# EAGLE design MPU9250-IMU(I2C_V1) (EAGLE 6.5.0)
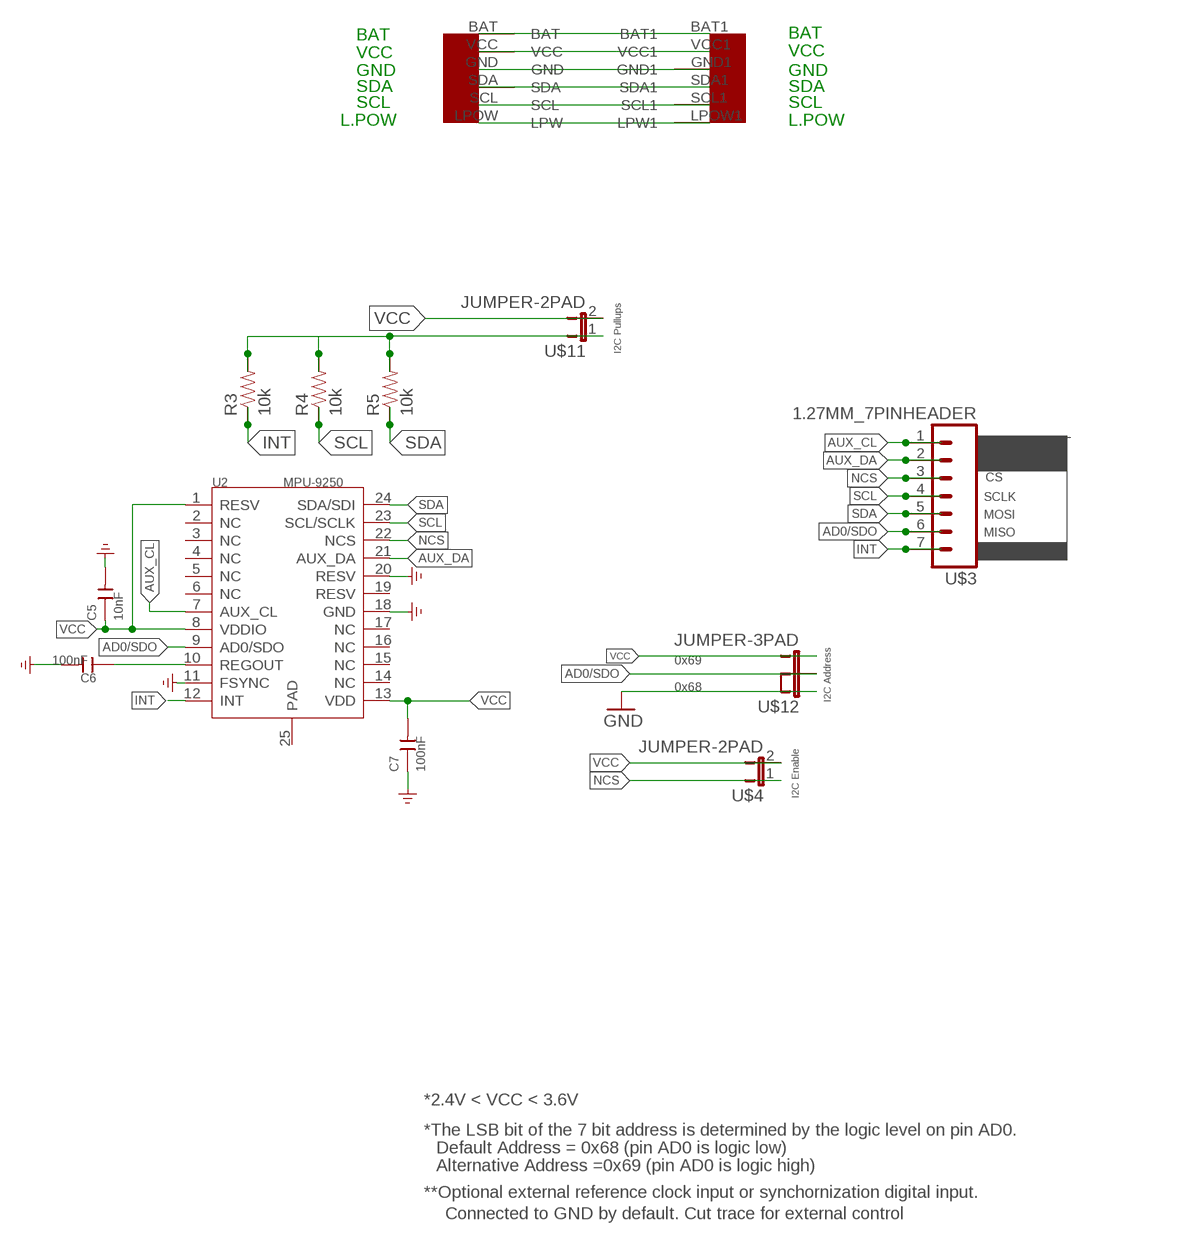
[diagram p0: schematic, sheet 1]

## Parts
C5  10nF  CAP-0603  [C0603]
C6  100nF  CAP-0603  [C0603]
C7  100nF  CAP-0603  [C0603]
R3  10k  RESISTOR0402-RES  [0402-RES]
R4  10k  RESISTOR0402-RES  [0402-RES]
R5  10k  RESISTOR0402-RES  [0402-RES]
U2  MPU-9250  [LEAD-QFN24]
U$1  EZ-I2CHEADERV1  [EZ-I2CHEADERV1]
U$3  1.27MM_7PINHEADER  [1.27MM_7PINHEADER]
U$4  JUMPER-2PAD  [JUMPER-2PAD]
U$11  JUMPER-2PAD  [JUMPER-2PAD]
U$12  JUMPER-3PAD  [JUMPER-3PAD]

## Nets
AD0/SDO: U2.9(AD0/SDO) U$3.6 U$12.2
AUX_CL: U2.7(AUX_CL) U$3.1
AUX_DA: U2.21(AUX_DA) U$3.2
BAT: U$1.BAT U$1.BAT1
GND: C5.2 C6.2 C7.1 U2.11(FSYNC) U2.18(GND) U2.20(RESV) U$1.GND U$1.GND1 U$12.1 ; supply symbol labelled GND_POWER
INT: R3.1 U2.12(INT) U$3.7
N$5: C6.1 U2.10(REGOUT)
N$6: U$1.LPOW1(LPW1) U$1.LPOW(LPW)
N$11: R3.2 R4.2 R5.2 U$11.1
NCS: U2.22(NCS) U$3.3 U$4.1
SCL: R4.1 U2.23(SCL/SCLK) U$1.SCL U$1.SCL1 U$3.4
SDA: R5.1 U2.24(SDA/SDI) U$1.SDA U$1.SDA1 U$3.5
VCC: C5.1 C7.2 U2.1(RESV) U2.8(VDDIO) U2.13(VDD) U$1.VCC U$1.VCC1 U$4.2 U$11.2 U$12.3
Unconnected: U2.2(NC) U2.3(NC) U2.4(NC) U2.5(NC) U2.6(NC) U2.14(NC) U2.15(NC) U2.16(NC) U2.17(NC) U2.19(RESV) U2.25(PAD)

## Notes on the sheet
- BAT | BAT
- VCC | VCC
- GND | GND
- SDA | SDA
- SCL | SCL
- L.POW | L.POW
- I2C Pullups
- CL
- DA
- CS
- SCLK
- MOSI
- MISO
- 0x69
- 0x68
- I2C Address
- I2C Enable
- *2.4V < VCC < 3.6V
- *The LSB bit of the 7 bit address is determined by the logic level on pin AD0.
- Default Address = 0x68 (pin AD0 is logic low)
- Alternative Address =0x69 (pin AD0 is logic high)
- **Optional external reference clock input or synchornization digital input.
- Connected to GND by default. Cut trace for external control

## Library data of the parts
C5-C7 = Discrete-new:CAP: Ceramic Capacitors
R3-R5 = SparkFun-Passives:RESISTOR: Resistor Basic schematic elements and footprints for 0603, 1206, and PTH resistors.; OC_FARNELL: unknown
U2 = template:MPU-9250
U$1 = UniqueInteractionsLib:EZ-I2CHEADERV1
U$3 = UniqueInteractionsLib:1.27MM_7PINHEADER
U$4 U$11 = UniqueInteractionsLib:JUMPER-2PAD
U$12 = UniqueInteractionsLib:JUMPER-3PAD

## Board
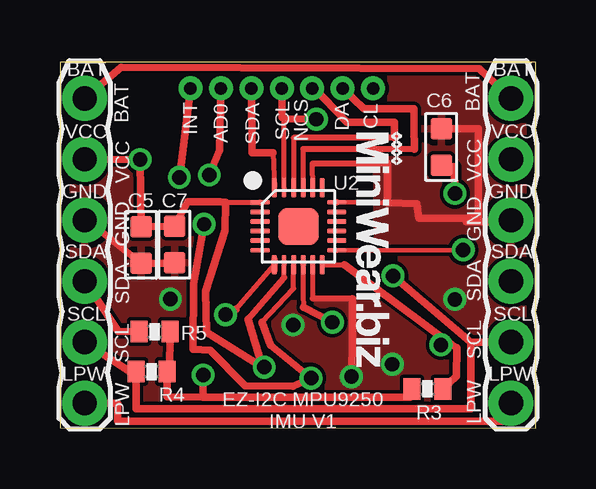
[diagram p1: board, top side]
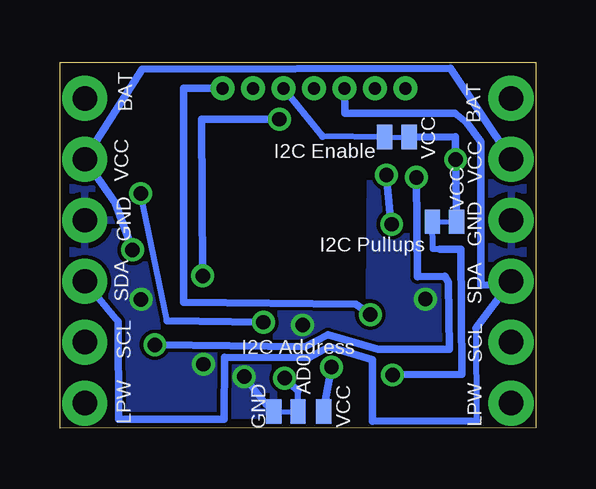
[diagram p2: board, bottom side, seen from below]

Size 19.84 x 15.23 mm. Coordinates in mm from the lower left corner, seen from the top.
Outline: 0,0.02 19.84,0 19.84,15.23 0,15.23 0,0.02
Copper layers (1*16): Top 0.0356mm / dielectric 1.5011mm / Bottom 0.0356mm
Design rules "oshParkPCBDesignRules": minimum track width 6mil, minimum drill 13mil, track to track 6mil, track to pad 6mil, pad to pad 6mil, via to via 6mil, smd to smd 6mil, copper to edge 15mil, drill to drill 6mil, minimum pad ring 7mil, minimum via ring 7mil, stop-mask expansion 3mil, vias tented up to drill 0mil, thermal gap 10mil

### Footprints (pad centres in the part's own frame; a part is rotated, then mirrored left to right if it is on the bottom)
C0603 = smd 0.889 x 0.889: 1 0,0.762; 2 0,-0.762
0402-RES = smd 0.7 x 0.9: 1 -0.65,0; 2 0.65,0
LEAD-QFN24 = smd 0.8 x 0.2: 1 -1.6,1; 2 -1.6,0.6; 3 -1.6,0.2; 4 -1.6,-0.2; 5 -1.6,-0.6; 6 -1.6,-1; 13 1.6,-1; 14 1.6,-0.6; 15 1.6,-0.2; 16 1.6,0.2; 17 1.6,0.6; 18 1.6,1 | smd 0.2 x 0.8: 7 -1,-1.6; 8 -0.6,-1.6; 9 -0.2,-1.6; 10 0.2,-1.6; 11 0.6,-1.6; 12 1,-1.6; 19 1,1.6; 20 0.6,1.6; 21 0.2,1.6; 22 -0.2,1.6; 23 -0.6,1.6; 24 -1,1.6 | smd 1.7 x 1.54: 25 0,0
EZ-I2CHEADERV1 = drill 1.016 pad 1.88: BAT 0,-1.27; BAT1 17.78,-1.27; GND 0,-6.35; GND1 17.78,-6.35; LPOW 0,-13.97; LPOW1 17.78,-13.97; SCL 0,-11.43; SCL1 17.78,-11.43; SDA 0,-8.89; SDA1 17.78,-8.89; VCC 0,-3.81; VCC1 17.78,-3.81
1.27MM_7PINHEADER = drill 0.508 pad 1: 1 0,0; 2 1.27,0; 3 2.54,0; 4 3.81,0; 5 5.08,0; 6 6.35,0; 7 7.62,0
JUMPER-2PAD = smd 0.635 x 1.016: 1 -0.508,0; 2 0.508,0
JUMPER-3PAD = smd 0.635 x 1.016: 1 -0.508,0; 2 0.508,0; 3 1.578,0

### Placement (x,y rotation side)
C5  3.38,7.63 0 top
C6  15.9,11.71 180 top
C7  4.78,7.64 180 top
R3  15.32,1.63 180 top
R4  3.82,2.35 0 top
R5  3.95,4.02 0 top
U2  9.95,8.41 0 top
U$1  1.03,15.01 0 top
U$2  [LOGO2]  12.17,12.42 270 top
U$3  13.06,14.15 180 top
U$4  5.79,12.12 0 bottom
U$11  3.81,8.6 0 bottom
U$12  10.42,0.68 0 bottom

### Tracks (layer width: path | path; a pad name or v marks a point on that pad's centre or on a via)
AD0/SDO  (via drill 0.6)
  Top 0.2: 8.42,4.41 9.74,5.81 U2.9
  Top 0.305: 8.42,4.41 8.77,3.46 v10.47,2.08 9.73,1.75 7.72,1.76 6.25,3.24 5.56,3.29 5.57,6.01 v6.01,8.5 | U$3.6 6.66,11.58 v6.23,10.54
  Bottom 0.254: U$12.2 9.92,1.56
  Bottom 0.305: 9.92,1.56 v10.47,2.08 | v6.23,10.54 6.06,8.73 6.05,8.61 6.02,8.59 v6.01,8.5
AUX_CL  (via drill 0.6)
  Top 0.2: 7.35,4.94 U2.7
  Top 0.254: U2.7 8.94,7.07 8.94,6.53
  Top 0.305: v6.91,4.73 7.35,4.94
  Bottom 0.305: U$3.1 14.69,14.17 14.7,5.23 7.51,5.17 v6.91,4.73
AUX_DA
  Top 0.2: 10.14,11.62 U2.21
  Top 0.254: 14.77,11.62 10.14,11.62
  Top 0.305: U$3.2 12.68,13.31 14.77,13.31 14.77,12.59 14.77,11.62
BAT
  Top 0.305: U$1.BAT 2.56,15.03 17.48,14.96 U$1.BAT1
GND  (via drill 0.6)
  Top 0.2: 10.54,5.4 U2.11 | 11.54,9.43 13.65,9.39 | U2.20 10.54,11.03
  Top 0.254: 12.19,5.38 10.54,5.4 | U2.18 11.54,9.43 | 10.54,11.03 13.65,11.03
  Top 0.305: C6.2 17.44,12.47 17.44,8.75 | 17.44,8.75 16.96,8.59 18.81,8.59 U$1.GND1 | C7.1 4.03,6.85 C5.2 1.03,8.74 U$1.GND | v12.16,2.15 12.19,3.26 12.19,5.38 | 17.44,8.75 14.96,8.75 14.89,9.35 13.65,9.39 13.65,11.03
  Bottom 0.254: U$12.1 11.25,0.99
  Bottom 0.305: 11.25,0.99 v12.16,2.15
  other vias: 13.86,2.66 4.6,5.38 9.72,4.3 16.47,5.36
  pour Top: 23.12,-1.24 -2.17,-1.2 -2.14,17.86 9.15,17.82 9.15,11.46 6.92,11.42 6.95,5.18 13.26,5.23 13.21,11.45 10.42,11.46 10.42,17.82 23.25,17.97
  pour Bottom: 20.58,-3.77 -2.95,-3.76 -2.96,19.06 7.88,19.09 9.15,11.46 7.03,11.44 6.93,11.23 6.89,11.01 6.93,5.19 13.22,5.24 13.24,11.47 10.42,11.48 11.69,19.09 20.72,19.22
INT  (via drill 0.6)
  Top 0.2: U2.12 11.87,6.81
  Top 0.305: 11.87,6.81 16.37,3.45 | 16.37,3.45 16.56,3.35 16.54,2.15 R3.1 | U$3.7 v4.98,10.45 | v15.88,3.47 16.37,3.45
  Bottom 0.305: v4.98,10.45 4.94,6.3 3.78,6.32 3.64,6.07 3.61,3.28 6.57,3.28 8.66,3.89 9.62,3.4 v15.88,3.47
N$5  (via drill 0.6)
  Top 0.2: U2.10 10.14,5.56 10.16,5.03
  Top 0.254: U2.10
  Top 0.305: 10.16,5.03 v11.36,4.41 | v16.47,9.78 16.44,10.89 C6.1
  Bottom 0.254: 15.37,4.47 v16.47,9.78
  Bottom 0.305: v11.36,4.41 15.37,4.47
N$6
  Top 0.305: U$1.LPOW 2.4,1.04 2.4,0.28 18.81,0.28 U$1.LPOW1
N$11  (via drill 0.6)
  Top 0.305: R3.2 14.59,1.28 5.97,1.29 | 5.97,1.29 4.46,1.3 R4.2 4.57,2.37 R5.2 4.6,4 | v5.97,2.21 5.97,1.29
  Bottom 0.254: 4,7.44 4.3,7.45 U$11.1
  Bottom 0.305: v5.97,2.21 3.08,2.24 3.12,7.45 4,7.44
NCS
  Top 0.2: 9.74,12.09 U2.22
  Top 0.254: 13.94,12.1 9.74,12.09
  Top 0.305: U$3.3 10.54,14.25 11.98,12.74 13.94,12.75 13.94,12.1
  Bottom 0.254: U$4.1 8.9,12.15
  Bottom 0.305: 8.9,12.15 U$3.3
SCL  (via drill 0.6)
  Top 0.2: U2.23 9.33,12.88
  Top 0.305: U$1.SCL 2.92,2.35 R4.1 3.17,0.8 17.14,0.8 17.14,3.58 | 17.14,3.58 U$1.SCL1 | 9.26,14.28 9.26,12.95 | 9.26,12.95 9.33,12.88 v10.69,12.87 | v13.89,6.34 17.14,3.58 | U$3.4 9.26,12.95
  Bottom 0.305: v10.69,12.87 13.93,12.86 v13.89,6.34
SDA
  Top 0.2: 8.89,11.48 U2.24
  Top 0.305: R5.1 2.44,4.04 1.5,5.45 U$1.SDA | U$3.5 8,11.48 8.89,11.48
  Bottom 0.254: 2.51,4.17 2.48,0.32
  Bottom 0.305: U$3.5 7.95,13.12 3.38,13.11 2.88,12.71 2.29,11.92 2.29,5.94 1.03,6.02 U$1.SDA 2.51,4.17 | U$1.SDA1 17.42,4.43 17.39,0.38 12.99,0.37 12.99,2.95 9.46,2.94 8.62,3.39 6.81,2.85 6.82,0.28 2.48,0.32
VCC  (via drill 0.6)
  Top 0.2: 9.35,6.26 U2.8 | 6.91,9.41 U2.1 | U2.13 v16.82,7.42
  Top 0.254: 7.85,4.53 9.35,6.26 | U2.1
  Top 0.305: 8.45,2.53 7.85,4.53 | 8.45,2.53 6.11,3.99 6.07,5.7 6.89,8.25 6.91,9.41 6.68,9.43 5.31,9.43 C7.2 C5.1 v3.34,11.19 U$1.VCC | v8.52,2.54 8.45,2.53
  Bottom 0.254: U$12.3 8.83,0.85
  Bottom 0.305: 8.83,0.85 v8.52,2.54 | 1.03,11.18 U$1.VCC 3.56,14.99 16.42,14.95 U$1.VCC1 17.53,9.38 v16.82,7.42 | U$11.2 v3.34,11.19 3.36,12.15 U$4.2

### Text on the board
tNames: INT | AD0 | SDA | SCL | NCS | DA | CL | EZ-I2C MPU9250 / IMU V1
bNames: VCC | I2C Enable | VCC | I2C Pullups | AD0 | I2C Address | VCC | GND